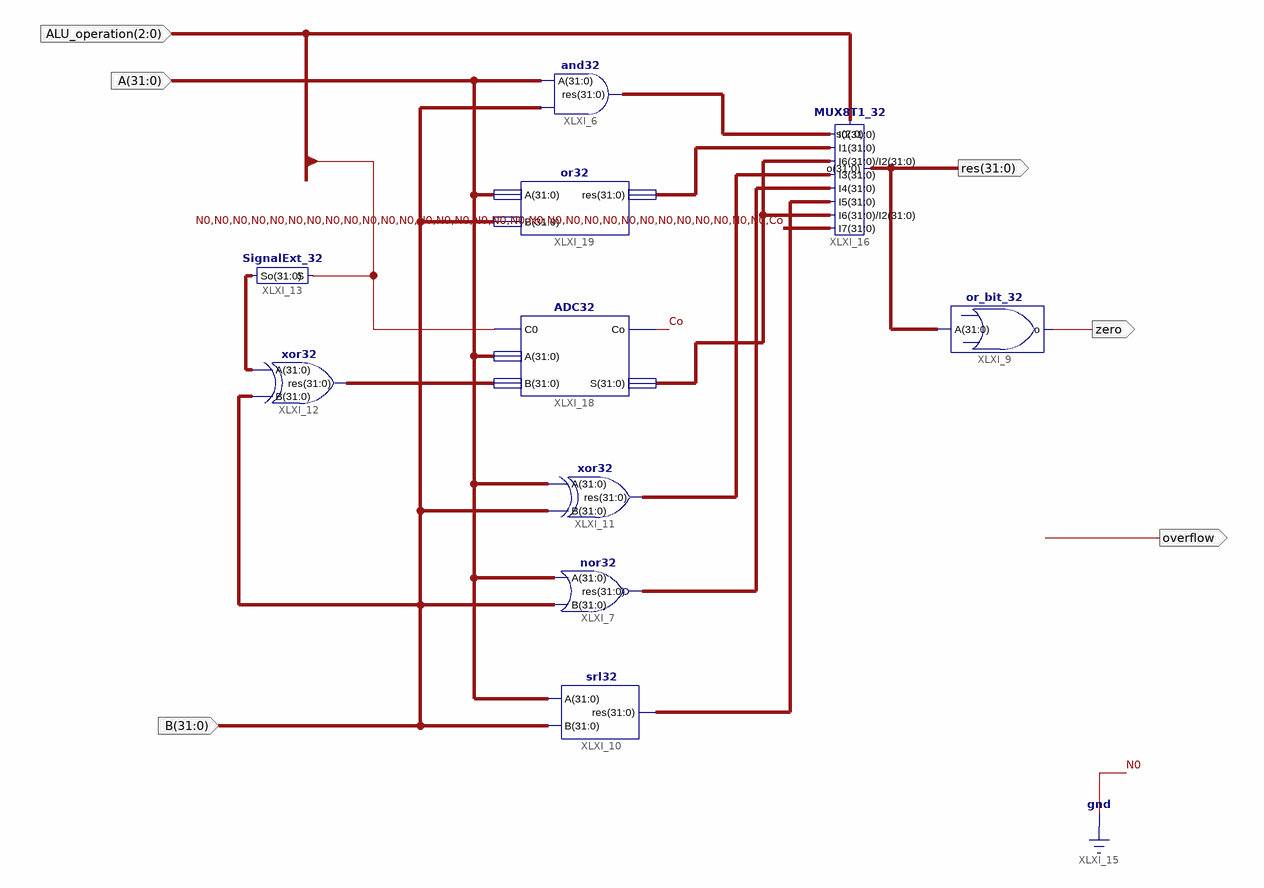
[diagram p0: schematic sheet 1]
// Xilinx ISE schematic ALU.sch (kintex7) as structural Verilog: 10 symbols, 6 ports
module ALU (
  input  [31:0] B,
  input  [31:0] A,
  input  [2:0] ALU_operation,
  output [31:0] res,
  output zero,
  output overflow
);

  wire Co;
  wire [31:0] S, XLXN_5, XLXN_12, XLXN_14, XLXN_15, XLXN_16, XLXN_29, XLXN_30;

  and32 XLXI_6 (.res(XLXN_12), .A(A), .B(B));
  nor32 XLXI_7 (.res(XLXN_15), .A(A), .B(B));
  or_bit_32 XLXI_9 (.o(zero), .A(res));
  srl32 XLXI_10 (.A(A), .B(B), .res(XLXN_16));
  xor32 XLXI_11 (.A(A), .B(B), .res(XLXN_14));
  xor32 XLXI_12 (.A(XLXN_5), .B(B), .res(XLXN_30));
  SignalExt_32 XLXI_13 (.So(XLXN_5), .S(ALU_operation[2]));
  MUX8T1_32 XLXI_16 (
    .s(ALU_operation), .I7({{31{1'b0}}, Co}), .I6(S), .I5(XLXN_16), .I4(XLXN_15), .I3(XLXN_14), .I2(S),
    .I1(XLXN_29), .I0(XLXN_12), .o(res));
  ADC32 XLXI_18 (.C0(ALU_operation[2]), .A(A), .B(XLXN_30), .Co(Co), .S(S));
  or32 XLXI_19 (.A(A), .B(B), .res(XLXN_29));
endmodule
